# EAGLE design working (EAGLE 9.6.2)

## Sheet 1 of 2
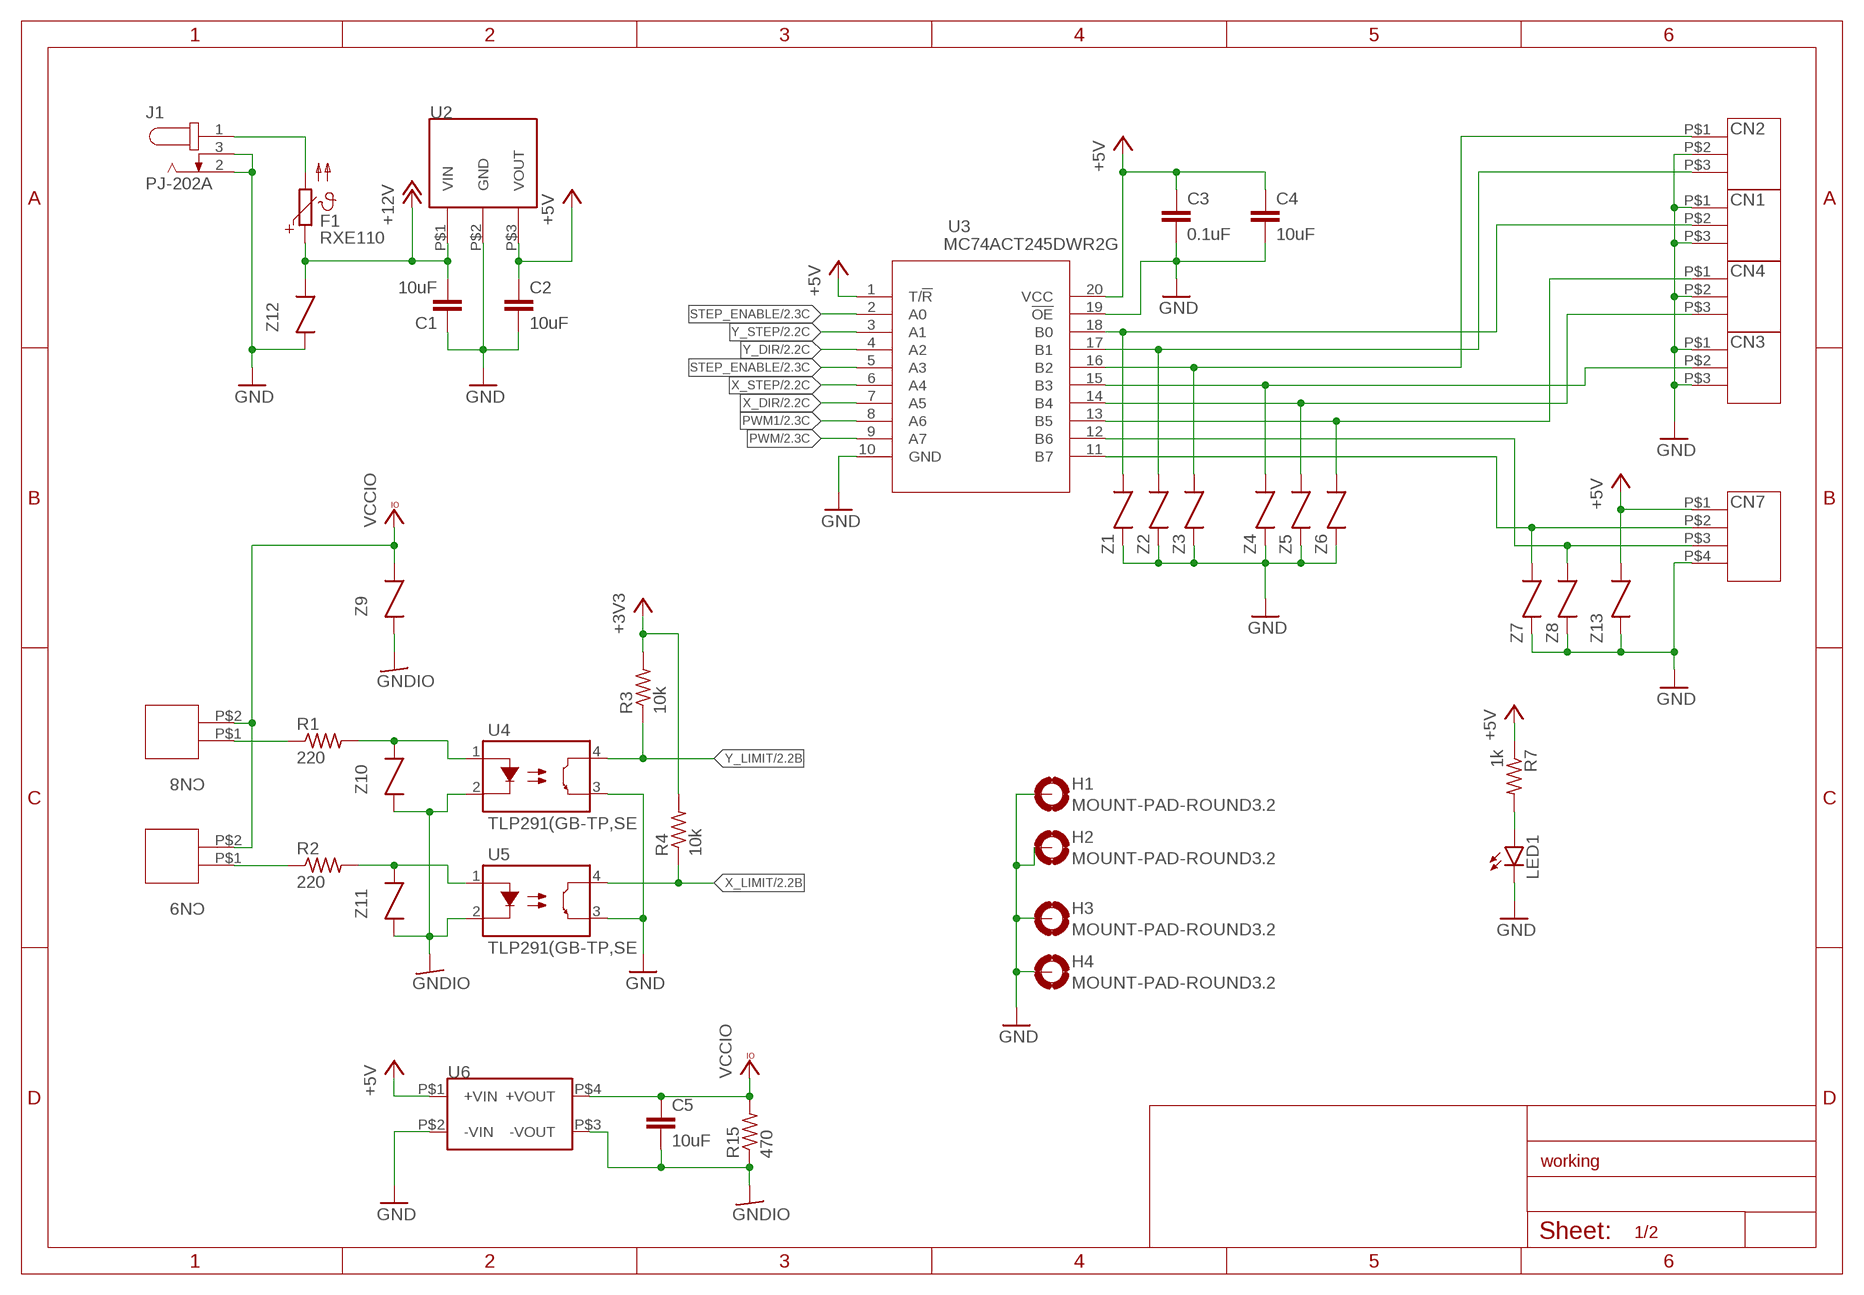
[diagram p0: schematic, sheet 1]

### Parts
C1  10uF  C-EUC0805  [C0805]
C2  10uF  C-EUC0805  [C0805]
C3  0.1uF  C-EUC0603  [C0603]
C4  10uF  C-EUC0805  [C0805]
C5  10uF  C-EUC0805  [C0805]
CN1  ETB43034G000Z  [ETB43034G000Z]
CN2  ETB43034G000Z  [ETB43034G000Z]
CN3  ETB43034G000Z  [ETB43034G000Z]
CN4  ETB43034G000Z  [ETB43034G000Z]
CN7  ETB43044G000Z  [ETB43044G000Z]
CN8  ETB43024G000Z  [ETB43024G000Z]
CN9  ETB43024G000Z  [ETB43024G000Z]
F1  RXE110  [RXE110]
H1  MOUNT-PAD-ROUND3.2  [3,2-PAD]
H2  MOUNT-PAD-ROUND3.2  [3,2-PAD]
H3  MOUNT-PAD-ROUND3.2  [3,2-PAD]
H4  MOUNT-PAD-ROUND3.2  [3,2-PAD]
J1  PJ-202A  [CUI_PJ-202A]
LED1  LED3MM  [LED3MM]
R1  220  R-US_R0603  [R0603]
R2  220  R-US_R0603  [R0603]
R3  10k  R-US_R0603  [R0603]
R4  10k  R-US_R0603  [R0603]
R7  1k  R-US_R0603  [R0603]
R15  470  R-US_R0603  [R0603]
U2  BP5293-50BP5293_SIDE  [BP5293_SIDE]
U3  MC74ACT245DWR2G  [SOIC-20WB_ONS]
U4  TLP291(GB-TP,SE  [SOIC127P700X220-4N]
U5  TLP291(GB-TP,SE  [SOIC127P700X220-4N]
U6  MAU102  [MAU100_SINGLE]
Z1  MLVC06V012C210  [0603]
Z2  MLVC06V012C210  [0603]
Z3  MLVC06V012C210  [0603]
Z4  MLVC06V012C210  [0603]
Z5  MLVC06V012C210  [0603]
Z6  MLVC06V012C210  [0603]
Z7  MLVC06V012C210  [0603]
Z8  MLVC06V012C210  [0603]
Z9  MLVC06V012C210  [0603]
Z10  MLVC06V012C210  [0603]
Z11  MLVC06V012C210  [0603]
Z12  MLVC06V026C120  [0603]
Z13  MLVC06V012C210  [0603]

### Nets
+3V3: R3.2 R4.2 ; also sheet 2
+5V: C2.2 C3.1 C4.2 CN7.P$1 R7.1 U2.P$3(VOUT) U3.1(T/!R) U3.20(VCC) U6.P$1(+VIN) Z13.1 ; also sheet 2
+12V: C1.2 F1.P$1 U2.P$1(VIN) Z12.1
GND: C1.1 C2.1 C3.2 C4.1 CN1.P$1 CN1.P$3 CN2.P$2 CN3.P$1 CN3.P$3 CN4.P$2 CN7.P$4 H1.B3,2(MOUNT) H2.B3,2(MOUNT) H3.B3,2(MOUNT) H4.B3,2(MOUNT) J1.2 J1.3 LED1.K(C) U2.P$2(GND) U3.10(GND) U3.19(!OE) U4.3(EMIT) U5.3(EMIT) U6.P$2(-VIN) Z1.2 Z2.2 Z3.2 Z4.2 Z5.2 Z6.2 Z7.2 Z8.2 Z12.2 Z13.2 ; also sheet 2
GNDIO: C5.1 R15.1 U4.2(C) U5.2(C) U6.P$3(-VOUT) Z9.2 Z10.2 Z11.2
LED1_PWM_5: CN7.P$3 U3.12(B6) Z8.1
LED_PWM_5: CN7.P$2 U3.11(B7) Z7.1
N$1: F1.P$2 J1.1
N$6: LED1.A R7.2
N$12: R1.2 U4.1(A) Z10.1
N$13: R2.2 U5.1(A) Z11.1
PWM: U3.9(A7) ; also sheet 2
PWM1: U3.8(A6) ; also sheet 2
STEP_EN_X_5: CN3.P$2 U3.15(B3) Z4.1
STEP_EN_Y_5: CN1.P$2 U3.18(B0) Z1.1
STEP_ENABLE: U3.2(A0) U3.5(A3) ; also sheet 2
VCCIO: C5.2 CN8.P$2 CN9.P$2 R15.2 U6.P$4(+VOUT) Z9.1
X_DIR: U3.7(A5) ; also sheet 2
X_DIR_5: CN4.P$1 U3.13(B5) Z6.1
X_LIMIT: R4.1 U5.4(COL) ; also sheet 2
X_LIMIT_IO: CN9.P$1 R2.1
X_STEP: U3.6(A4) ; also sheet 2
X_STEP_5: CN4.P$3 U3.14(B4) Z5.1
Y_DIR: U3.4(A2) ; also sheet 2
Y_DIR_5: CN2.P$1 U3.16(B2) Z3.1
Y_LIMIT: R3.1 U4.4(COL) ; also sheet 2
Y_LIMIT_IO: CN8.P$1 R1.1
Y_STEP: U3.3(A1) ; also sheet 2
Y_STEP_5: CN2.P$3 U3.17(B1) Z2.1

## Sheet 2 of 2
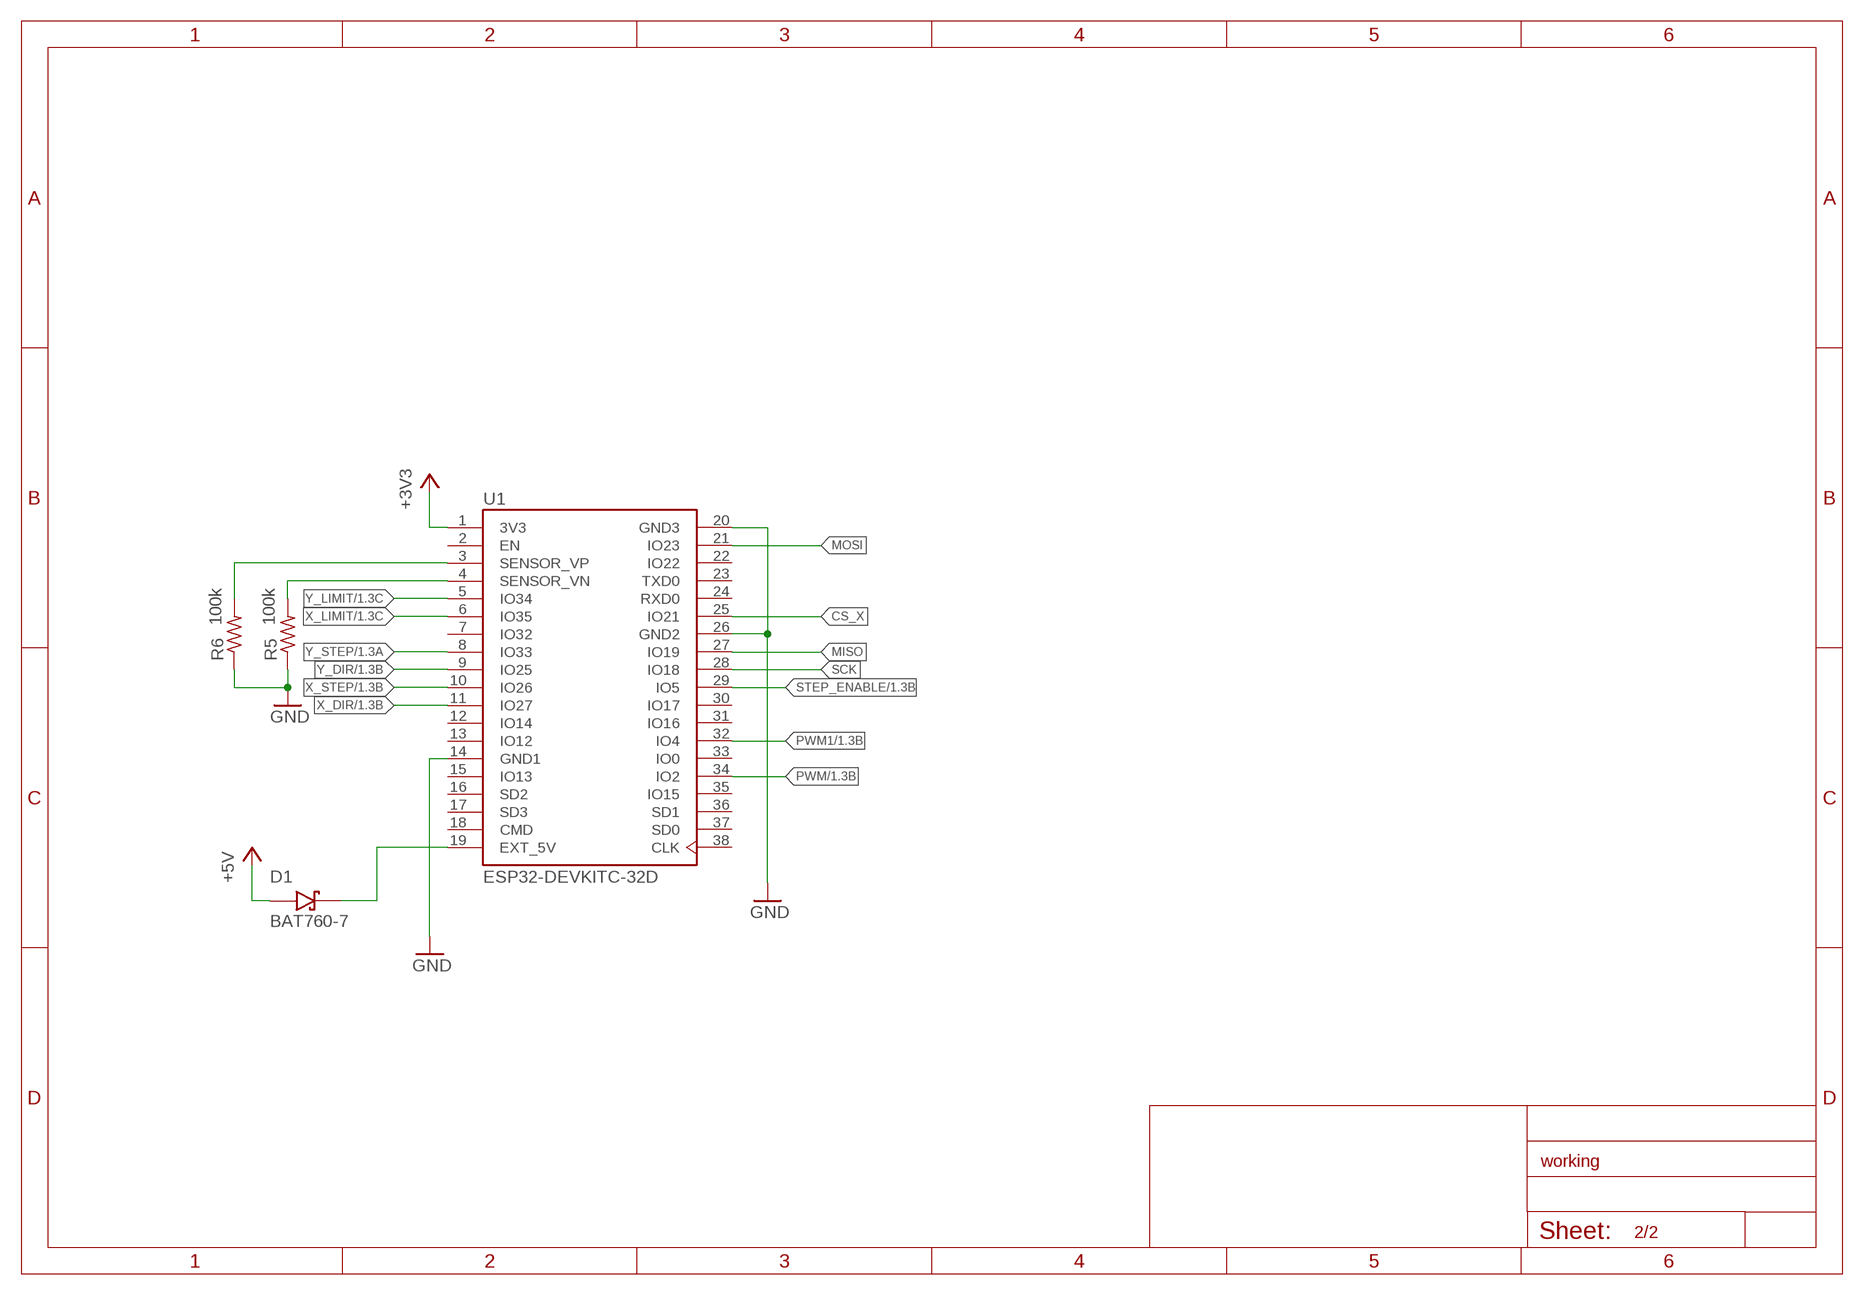
[diagram p1: schematic, sheet 2]

### Parts
D1  BAT760-7  [SOD2513X120N]
R5  100k  R-US_R0603  [R0603]
R6  100k  R-US_R0603  [R0603]
U1  ESP32-DEVKITC-32D  [MODULE_ESP32-DEVKITC-32D]

### Nets
+3V3: U1.1(3V3) ; also sheet 1
+5V: D1.A ; also sheet 1
CS_X: U1.25(IO21)
GND: R5.1 R6.1 U1.14(GND1) U1.20(GND3) U1.26(GND2) ; also sheet 1
MISO: U1.27(IO19)
MOSI: U1.21(IO23)
N$2: D1.C(K) U1.19(EXT_5V)
N$15: R6.2 U1.3(SENSOR_VP)
N$16: R5.2 U1.4(SENSOR_VN)
PWM: U1.34(IO2) ; also sheet 1
PWM1: U1.32(IO4) ; also sheet 1
SCK: U1.28(IO18)
STEP_ENABLE: U1.29(IO5) ; also sheet 1
X_DIR: U1.11(IO27) ; also sheet 1
X_LIMIT: U1.6(IO35) ; also sheet 1
X_STEP: U1.10(IO26) ; also sheet 1
Y_DIR: U1.9(IO25) ; also sheet 1
Y_LIMIT: U1.5(IO34) ; also sheet 1
Y_STEP: U1.8(IO33) ; also sheet 1
Unconnected: U1.2(EN) U1.7(IO32) U1.12(IO14) U1.13(IO12) U1.15(IO13) U1.16(SD2) U1.17(SD3) U1.18(CMD) U1.22(IO22) U1.23(TXD0) U1.24(RXD0) U1.30(IO17) U1.31(IO16) U1.33(IO0) U1.35(IO15) U1.36(SD1) U1.37(SD0) U1.38(CLK)

## Library data of the parts
C1-C5 = 2_Axis_External_Driver:C-EU: CAPACITOR, European symbol; SPICEPREFIX: C
CN1-CN4 = 2_Axis_External_Driver:ETB43034G000Z: ETB43034G000Z https://akizukidenshi.com/download/ds/alphaplus/etb43.pdf
CN7 = 2_Axis_External_Driver:ETB43044G000Z: ETB43044G000Z https://akizukidenshi.com/catalog/g/gP-11601/
CN8 CN9 = 2_Axis_External_Driver:ETB43024G000Z: ETB43024G000Z https://akizukidenshi.com/catalog/g/gP-11599/
D1 = 2_Axis_External_Driver:BAT760-7: Diode Schottky 30V 1A Surface Mount SOD-323 Check availability <https://pricing.snapeda.com/parts/BAT760-7/Diodes%20Inc./view-part?ref=eda>; AVAILABILITY: In Stock; DESCRIPTION: Diode Schottky 30 V 1A Surface Mount SOD-323; MF: Diodes Inc.; MP: BAT760-7; PACKAGE: SOD-323 Diodes Inc.; PRICE: None; PURCHASE-URL: https://pricing.snapeda.com/search/part/BAT760-7/?ref=eda
F1 = 2_Axis_External_Driver:RXE110: https://akizukidenshi.com/catalog/g/gP-00273/
H1-H4 = 2_Axis_External_Driver:MOUNT-PAD-ROUND: MOUNTING PAD, round
J1 = 2_Axis_External_Driver:PJ-202A: 2.0 mm Center Pin, 2.5 A, Right Angle, Through Hole, Kinked Pins, Dc Power Jack Connector Check prices <https://pricing.snapeda.com/parts/PJ-202A/CUI%20Devices/view-part?ref=eda>; AVAILABILITY: In Stock; CUI_PURCHASE_URL: https://www.cuidevices.com/product/interconnect/connectors/dc-power-connectors/jacks/pj-202a?utm_source=snapeda.com&utm_medium=referral&utm_campaign=snapedaBOM; DESCRIPTION: 2.0 x 6.5 mm, 2.5 A, Horizontal, Through Hole, Kinked Pins, Dc Power Jack Connector; MF: CUI Devices; MP: PJ-202A; PACKAGE: None; PRICE: None; PURCHASE-URL: https://pricing.snapeda.com/search/part/PJ-202A/?ref=eda
LED1 = 2_Axis_External_Driver:LED: LED OSRAM: - CHIPLED LG R971, LG N971, LY N971, LG Q971, LY Q971, LO R971, LY R971 LH N974, LH R974 LS Q976, LO Q976, LY Q976 LO Q996 - Hyper CHIPLED LW Q18S LB Q993, LB Q99A, LB R99A - SideLED LS A670, LO A670, LY A670, LG A670, LP A670 LB A673, LV A673, LT A673, LW A673 LH A674 LY A675 LS A676, LA A676, LO A676, LY A676, LW A676 LS A679, LY A679, LG A679 - Hyper Micro SIDELED® LS Y876, LA Y876, LO Y876, LY Y876 LT Y87S - SmartLED LW L88C, LW L88S LB L89C, LB L89S, LG L890 LS L89K, LO L89K, LY L89K LS L896, LA L896, LO L896, LY L896 - TOPLED LS T670, LO T670, LY T670, LG T670, LP T670 LSG T670, LSP T670, LSY T670, LOP T670, LYG T670 LG T671, LOG T671, LSG T671 LB T673, LV T673, LT T673, LW T673 LH T674 LS T676, LA T676, LO T676, LY T676, LB T676, LH T676, LSB T676, LW T676 LB T67C, LV T67C, LT T67C, LS T67K, LO T67K, LY T67K, LW E67C LS E67B, LA E67B, LO E67B, LY E67B, LB E67C, LV E67C, LT E67C LW T67C LS T679, LY T679, LG T679 LS T770, LO T770, LY T770, LG T770, LP T770 LB T773, LV T773, LT T773, LW T773 LH T774 LS E675, LA E675, LY E675, LS T675 LS T776, LA T776, LO T776, LY T776, LB T776 LHGB T686 LT T68C, LB T68C - Hyper Mini TOPLED® LB M676 - Mini TOPLED Santana® LG M470 LS M47K, LO M47K, LY M47K Source: http://www.osram.convergy.de LUXEON: - LUMILED® LXK2-PW12-R00, LXK2-PW12-S00, LXK2-PW14-U00, LXK2-PW14-V00 LXK2-PM12-R00, LXK2-PM12-S00, LXK2-PM14-U00 LXK2-PE12-Q00, LXK2-PE12-R00, LXK2-PE12-S00, LXK2-PE14-T00, LXK2-PE14-U00 LXK2-PB12-K00, LXK2-PB12-L00, LXK2-PB12-M00, LXK2-PB14-N00, LXK2-PB14-P00, LXK2-PB14-Q00 LXK2-PR12-L00, LXK2-PR12-M00, LXK2-PR14-Q00, LXK2-PR14-R00 LXK2-PD12-Q00, LXK2-PD12-R00, LXK2-PD12-S00 LXK2-PH12-R00, LXK2-PH12-S00 LXK2-PL12-P00, LXK2-PL12-Q00, LXK2-PL12-R00 Source: www.luxeon.com KINGBRIGHT: KA-3528ASYC Source: www.kingbright.com
R1-R7 R15 = 2_Axis_External_Driver:R-US_: RESISTOR, American symbol; SPICEPREFIX: R
U1 = 2_Axis_External_Driver:ESP32-DEVKITC-32D: Eval Board For Esp-Wroom-32 Check prices <https://pricing.snapeda.com/parts/ESP32-DEVKITC-32D/Espressif%20Systems/view-part?ref=eda>; AVAILABILITY: In Stock; DESCRIPTION: WiFi Development Tools (802.11) ESP32 General Development Kit, ESP32-WROOM-32D on the board; MF: Espressif Systems; MP: ESP32-DEVKITC-32D; PACKAGE: None; PRICE: None
U2 = 2_Axis_External_Driver:BP5293-50: BP5293 https://akizukidenshi.com/catalog/g/gM-11188/
U3 = 2_Axis_External_Driver:MC74ACT245DWR2G; COPYRIGHT: Copyright (C) 2022 Ultra Librarian. All rights reserved.; MANUFACTURER_PART_NUMBER: MC74ACT245DWR2G; MFR_NAME: onsemi
U4 U5 = 2_Axis_External_Driver:TLP291(GB-TP,SE: Optoisolator Transistor Output 3750Vrms 1 Channel 4-SO Check availability <https://pricing.snapeda.com/parts/TLP291%28GB-TP%2CSE/Toshiba%20Semiconductor/view-part?ref=eda>; AVAILABILITY: In Stock; DESCRIPTION: Optoisolator Transistor Output 3750Vrms 1 Channel 4-SO; MF: Toshiba Semiconductor; MP: TLP291(GB-TP,SE; PACKAGE: SO-4 Toshiba Semiconductor; PRICE: None; PURCHASE-URL: https://pricing.snapeda.com/search/part/TLP291(GB-TP,SE/?ref=eda
U6 = 2_Axis_External_Driver:MAU102: https://akizukidenshi.com/catalog/g/gM-04131/
Z1-Z11 Z13 = 2_Axis_External_Driver:MLVC06V012C210: https://www.mouser.jp/ProductDetail/Bussmann-Eaton/MLVC06V012C210?qs=pUKx8fyJudBlDBwUQ7TVbQ%3D%3D バリスタ 12VDC 210PF
Z12 = 2_Axis_External_Driver:MLVC06V026C120: https://www.mouser.jp/ProductDetail/Bussmann-Eaton/MLVC06V026C120?qs=pUKx8fyJudD3x2tRqD2agg%3D%3D バリスタ 26VDC 120PF

## Board
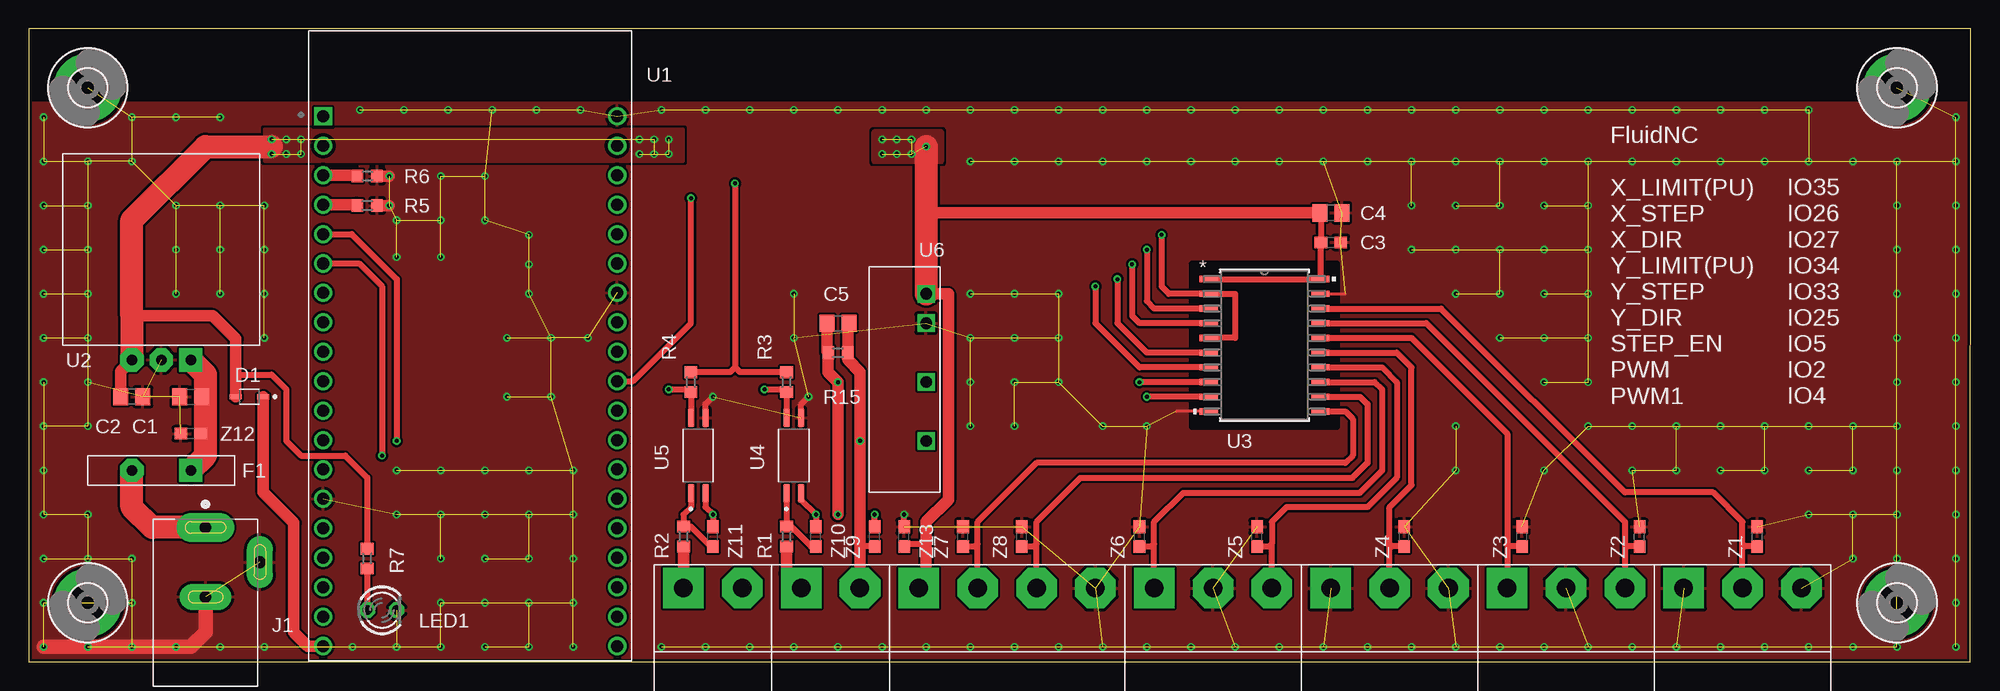
[diagram p2: board, top side]
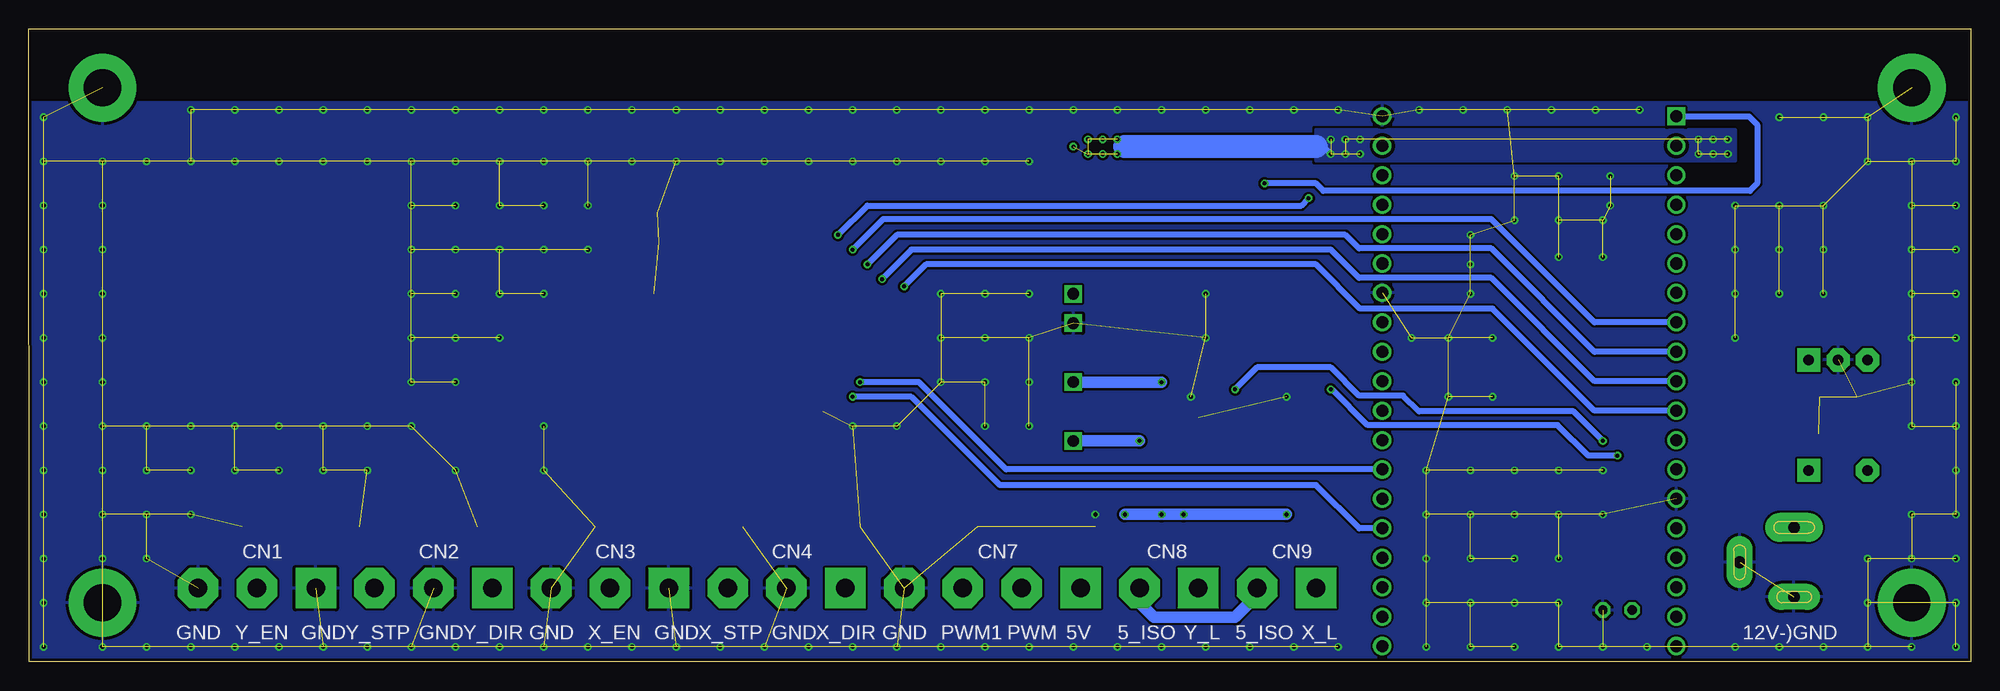
[diagram p3: board, bottom side, seen from below]

Size 167.64 x 54.61 mm. Coordinates in mm from the lower left corner, seen from the top.
Outline: 0,0 167.62,0 167.64,54.61 0,54.61 0,0
Copper layers (1*16): Top 0.035mm / dielectric 1.5mm / Bottom 0.035mm
Design rules "SeeedStudio_2layer_DRU_no_angle_20140221": minimum track width 6mil, minimum drill 12mil, track to track 6mil, track to pad 6mil, pad to pad 6mil, via to via 6mil, smd to smd 0mil, copper to edge 10mil, drill to drill 10mil, minimum pad ring 10mil, minimum via ring 6mil, stop-mask expansion 2mil, vias tented up to drill 100mil, thermal gap 10mil

### Footprints (pad centres in the part's own frame; a part is rotated, then mirrored left to right if it is on the bottom)
C0805 = smd 1.3 x 1.5: 1 -0.95,0; 2 0.95,0
C0603 = smd 1.1 x 1: 1 -0.85,0; 2 0.85,0
ETB43034G000Z = drill 1.6 pad 3.5 square: P$1 -5.08,0 | drill 1.6 pad 3.5 octagon: P$2 0,0; P$3 5.08,0
ETB43044G000Z = drill 1.6 pad 3.5 square: P$1 -7.62,0 | drill 1.6 pad 3.5 octagon: P$2 -2.54,0; P$3 2.54,0; P$4 7.62,0
ETB43024G000Z = drill 1.6 pad 3.5 square: P$1 -2.54,0 | drill 1.6 pad 3.5 octagon: P$2 2.54,0
SOD2513X120N = smd 1.04 x 0.46: A 1.19,0; C -1.19,0
RXE110 = drill 0.9 pad 2 square: P$1 0,0 | drill 0.9 pad 2 octagon: P$2 5.08,0
3,2-PAD = drill 3.2 pad 5.842: B3,2 0,0
CUI_PJ-202A = drill 1 pad 2.5 long: 1 -6.5,0 | drill 1 pad 2.25 long: 2 -0.5,0; 3 -3.5,4.7
LED3MM = drill 0.813 octagon: A -1.27,0; K 1.27,0
R0603 = smd 1 x 1.1: 1 -0.85,0; 2 0.85,0
MODULE_ESP32-DEVKITC-32D = drill 1.04 square: 1 -12.7,19.76 | drill 1.04: 2 -12.7,17.22; 3 -12.7,14.68; 4 -12.7,12.14; 5 -12.7,9.6; 6 -12.7,7.06; 7 -12.7,4.52; 8 -12.7,1.98; 9 -12.7,-0.56; 10 -12.7,-3.1; 11 -12.7,-5.64; 12 -12.7,-8.18; 13 -12.7,-10.72; 14 -12.7,-13.26; 15 -12.7,-15.8; 16 -12.7,-18.34; 17 -12.7,-20.88; 18 -12.7,-23.42; 19 -12.7,-25.96; 20 12.7,19.76; 21 12.7,17.22; 22 12.7,14.68; 23 12.7,12.14; 24 12.7,9.6; 25 12.7,7.06; 26 12.7,4.52; 27 12.7,1.98; 28 12.7,-0.56; 29 12.7,-3.1; 30 12.7,-5.64; 31 12.7,-8.18; 32 12.7,-10.72; 33 12.7,-13.26; 34 12.7,-15.8; 35 12.7,-18.34; 36 12.7,-20.88; 37 12.7,-23.42; 38 12.7,-25.96
BP5293_SIDE = drill 0.9 pad 2 square: P$1 -2.54,0 | drill 0.9 pad 2 octagon: P$2 0,0; P$3 2.54,0
SOIC-20WB_ONS = smd 1.589 x 0.533: 1 -4.826,5.715; 2 -4.826,4.445; 3 -4.826,3.175; 4 -4.826,1.905; 5 -4.826,0.635; 6 -4.826,-0.635; 7 -4.826,-1.905; 8 -4.826,-3.175; 9 -4.826,-4.445; 10 -4.826,-5.715; 11 4.826,-5.715; 12 4.826,-4.445; 13 4.826,-3.175; 14 4.826,-1.905; 15 4.826,-0.635; 16 4.826,0.635; 17 4.826,1.905; 18 4.826,3.175; 19 4.826,4.445; 20 4.826,5.715
SOIC127P700X220-4N = smd 1.61 x 0.57: 1 -3.25,0.635; 2 -3.25,-0.635; 3 3.25,-0.635; 4 3.25,0.635
MAU100_SINGLE = drill 1 square: P$1 0,0; P$2 2.54,0; P$3 7.62,0; P$4 12.7,0
0603 = smd 1.1 x 1: 1 -0.85,0; 2 0.85,0

### Placement (x,y rotation side)
C1  13.97,22.86 0 top
C2  8.89,22.86 180 top
C3  112.39,36.2 0 top
C4  112.39,38.73 180 top
C5  69.85,29.21 0 top
CN1  147.96,6.35 0 top
CN2  132.72,6.35 0 top
CN3  117.47,6.35 0 top
CN4  102.23,6.35 0 top
CN7  84.45,6.35 0 top
CN8  69.22,6.35 0 top
CN9  59.05,6.35 0 top
D1  19.05,22.86 180 top
F1  13.97,16.51 180 top
H1  5.08,49.53 0 top
H2  5.08,5.08 0 top
H3  161.29,5.08 0 top
H4  161.29,49.53 0 top
J1  15.24,5.08 270 top
LED1  30.48,4.45 0 top
R1  65.41,10.79 90 top
R2  56.52,10.79 90 top
R3  65.41,24.13 90 top
R4  57.15,24.13 90 top
R5  29.21,39.37 180 top
R6  29.21,41.91 180 top
R7  29.21,8.89 270 top
R15  69.85,26.67 0 top
U1  38.1,27.3 0 top
U2  11.43,26.04 180 top
U3  106.68,27.3 0 top
U4  66.04,17.78 90 top
U5  57.78,17.78 90 top
U6  77.47,31.75 270 top
Z1  149.22,10.79 90 top
Z2  139.06,10.79 90 top
Z3  128.91,10.79 90 top
Z4  118.75,10.79 90 top
Z5  106.05,10.79 90 top
Z6  95.89,10.79 90 top
Z7  80.64,10.79 90 top
Z8  85.72,10.79 90 top
Z9  73.03,10.79 90 top
Z10  67.94,10.79 90 top
Z11  59.05,10.79 90 top
Z12  13.97,19.68 180 top
Z13  75.56,10.79 90 top

### Tracks (layer width: path | path; a pad name or v marks a point on that pad's centre or on a via)
+3V3  (via drill 0.35)
  Top 0.5: v60.96,41.27 60.96,25.4 | 60.96,25.4 60.54,24.98 R4.2 | R3.2 61.38,24.98 60.96,25.4
  Bottom 0.5: U1.1 19.12,47.06 18.41,46.35 18.41,41.27 19.05,40.64 55.88,40.64 56.52,41.27 v60.96,41.27
+5V  (via drill 0.35)  (17 unrouted)
  Top 0.5: U3.1 U3.20 111.51,36.16 C3.1 111.55,38.63 C4.2 | Z13.1 75.78,10.16 77.47,10.16 | 17.86,24.77 20.95,24.77 22.23,23.5 22.23,19.05 23.5,17.78 27.3,17.78 29.21,15.88 R7.1 | 20.95,44.45 v20.95,45.09
  Top 1: C2.2 7.94,25.09 U2.P$3 | D1.A 17.86,24.77 17.86,27.86 15.88,29.84 8.89,29.84 | CN7.P$1 77.47,6.99 77.47,10.16 77.47,12.06 79.38,13.97 79.38,31.75 U6.P$1 | C4.2 77.47,38.73
  Top 2: U2.P$3 8.89,29.84 8.89,38.1 15.24,44.45 20.95,44.45 | v77.47,44.45 77.47,38.73 U6.P$1
  Bottom 0.5: v55.24,43.81 55.88,44.45 56.52,44.45 | 73.03,44.45 v73.66,45.09
  Bottom 2: 56.52,44.45 73.03,44.45
  other vias: 22.23,45.09 22.23,43.81 20.95,43.81 23.5,45.09 23.5,43.81 52.7,45.09 52.7,43.81 53.98,45.09 53.98,43.81 55.24,45.09 74.93,45.09 74.93,43.81 76.2,43.81 76.2,45.09 73.66,43.81
  pour Top (isolate 0.3): 20.32,45.97 20.32,43.18 56.52,43.18 56.52,45.97
  pour Bottom (isolate 0.3): 20.32,45.97 20.32,43.18 56.52,43.18 56.52,45.97
  pour Top: 73.03,45.72 78.74,45.72 78.74,43.18 73.03,43.18
+12V
  Top 0.5: C1.2 15.24,22.86 | Z12.1 15.24,19.68
  Top 2: F1.P$1 15.24,17.78 15.24,19.68 15.24,22.86 15.24,24.77 U2.P$1
GND  (via drill 0.35)  (278 unrouted)
  Top 0.25: U3.10 99.06,21.59 | U3.19 113.67,31.75
  Top 0.5: U4.3 66.67,22.23 v67.31,22.86 | U5.3 58.42,22.23 v59.05,22.86 | Z13.2 v75.56,12.7
  Top 1: R6.1 v31.11,41.91 | R5.1 v31.11,39.37
  Top 1.27: J1.2 15.24,2.54 13.97,1.27 v1.27,1.27
  other vias: 45.09,27.94 45.09,22.86 48.26,27.94 43.18,34.29 43.18,36.83 43.18,31.75 41.27,27.94 41.27,22.86 1.27,5.08 1.27,8.89 1.27,12.7 1.27,16.51 1.27,20.32 1.27,24.13 1.27,27.94 1.27,31.75 1.27,35.56 1.27,39.37 1.27,43.18 1.27,46.99 28.57,47.62 32.38,47.62 36.2,47.62 40.01,47.62 43.81,47.62 47.62,47.62 54.61,47.62 58.42,47.62 62.23,47.62 66.04,47.62 69.85,47.62 73.66,47.62 77.47,47.62 81.28,47.62 85.09,47.62 88.9,47.62 92.71,47.62 96.52,47.62 100.33,47.62 104.14,47.62 107.95,47.62 111.76,47.62 115.57,47.62 119.38,47.62 123.19,47.62 166.37,46.99 166.37,39.37 166.37,43.18 166.37,31.75 166.37,35.56 166.37,24.13 166.37,27.94 166.37,16.51 166.37,20.32 166.37,8.89 166.37,12.7 166.37,1.27 166.37,5.08 157.48,1.27 161.29,1.27 115.57,1.27 119.38,1.27 123.19,1.27 104.14,1.27 107.95,1.27 111.76,1.27 92.71,1.27 96.52,1.27 100.33,1.27 81.28,1.27 85.09,1.27 88.9,1.27 69.85,1.27 73.66,1.27 77.47,1.27 58.42,1.27 62.23,1.27 66.04,1.27 46.99,1.27 54.61,1.27 35.56,1.27 39.37,1.27 43.18,1.27 27.94,1.27 31.75,1.27 12.7,1.27 16.51,1.27 20.32,1.27 5.08,1.27 8.89,1.27 12.7,46.99 8.89,46.99 8.89,43.18 5.08,43.18 5.08,39.37 5.08,35.56 5.08,31.75 5.08,27.94 5.08,24.13 5.08,20.32 5.08,12.7 5.08,8.89 8.89,8.89 8.89,5.08 35.56,5.08 39.37,5.08 43.18,5.08 46.99,5.08 35.56,8.89 39.37,8.89 43.18,8.89 46.99,8.89 46.99,12.7 43.18,12.7 39.37,12.7 35.56,12.7 31.75,12.7 31.75,16.51 35.56,16.51 39.37,16.51 43.18,16.51 46.99,16.51 39.37,41.91 35.56,41.91 39.37,38.1 35.56,38.1 35.56,34.92 31.75,34.92 31.75,38.1 16.51,39.37 20.32,39.37 12.7,39.37 20.32,35.56 16.51,35.56 12.7,35.56 12.7,31.75 16.51,31.75 20.32,31.75 20.32,27.94 161.29,43.18 161.29,39.37 161.29,35.56 161.29,31.75 161.29,27.94 161.29,24.13 161.29,20.32 161.29,16.51 161.29,12.7 161.29,8.89 157.48,43.18 157.48,20.32 157.48,16.51 157.48,12.7 157.48,8.89 153.67,12.7 153.67,16.51 153.67,20.32 88.9,31.75 88.9,27.94 85.09,31.75 85.09,27.94 81.28,31.75 81.28,27.94 88.9,24.13 85.09,24.13 81.28,24.13 81.28,20.32 85.09,20.32 92.71,20.32 96.52,20.32 16.51,46.99 153.67,43.18 127,47.62 130.81,47.62 134.62,47.62 138.43,47.62 142.24,47.62 146.05,47.62 149.86,47.62 153.67,47.62 149.86,43.18 149.86,20.32 149.86,16.51 146.05,43.18 146.05,20.32 146.05,16.51 142.24,16.51 142.24,20.32 142.24,43.18 146.05,1.27 149.86,1.27 153.67,1.27 134.62,1.27 138.43,1.27 142.24,1.27 127,1.27 130.81,1.27 138.43,43.18 138.43,20.32 134.62,20.32 134.62,24.13 134.62,27.94 134.62,31.75 134.62,35.56 134.62,39.37 134.62,43.18 138.43,16.51 130.81,24.13 130.81,27.94 130.81,31.75 130.81,35.56 130.81,39.37 130.81,43.18 127,27.94 127,31.75 127,35.56 127,39.37 127,43.18 123.19,31.75 123.19,35.56 123.19,39.37 123.19,43.18 81.28,43.18 85.09,43.18 88.9,43.18 92.71,43.18 96.52,43.18 100.33,43.18 104.14,43.18 107.95,43.18 111.76,43.18 115.57,43.18 119.38,35.56 119.38,39.37 119.38,43.18 130.81,16.51 123.19,16.51 123.19,20.32 66.04,31.75 66.04,27.94
  pour Top (isolate 0.2, rank 2): 0,0 0,48.26 167.64,48.26 167.64,0
  pour Bottom (isolate 0.2, rank 2): 0,0 0,48.26 167.64,48.26 167.64,0
GNDIO  (via drill 0.35)
  Top 0.5: U5.2 58.42,13.34 v59.05,12.7 Z11.2 | U4.2 66.67,13.97 v67.94,12.7 Z10.2 | Z9.2 v73.03,12.7
  Top 1: v69.85,12.7 v69.85,24.13 69,24.98 R15.1 68.9,26.77 C5.1
  Bottom 1: v59.05,12.7 v67.94,12.7 v69.85,12.7 v73.03,12.7 | U6.P$3 v69.85,24.13
LED1_PWM_5
  Top 0.5: CN7.P$3 87,10.16 | Z8.1 86.78,9.95 87,10.16 | 87,10.16 87,12.06 90.79,15.86 114.28,15.86 115.57,17.14 115.57,22.23 114.94,22.86 U3.12
LED_PWM_5
  Top 0.5: CN7.P$2 81.92,10.16 | Z7.1 81.7,9.95 81.92,10.16 | 81.92,10.16 81.92,12.06 87,17.14 113.67,17.14 114.3,17.78 114.3,20.95 113.67,21.59 U3.11
N$1
  Top 2: J1.1 10.64,11.58 8.89,13.34 F1.P$2
N$2
  Top 1: U1.19 24.05,1.34 22.86,2.54 22.86,11.98 20.24,14.61 D1.C
N$6
  Top 0.5: R7.2 LED1.A
N$12
  Top 0.5: U4.1 R1.2 65.83,11.64 67.53,9.95 Z10.1
N$13
  Top 0.5: Z11.1 58.85,9.95 57.15,11.64 R2.2 56.52,12.7 57.15,13.34 U5.1
N$15
  Top 1: U1.3 28.29,41.98 R6.2
N$16
  Top 1: U1.4 28.29,39.45 R5.2
PWM  (via drill 0.35)
  Top 0.5: U3.9 v96.52,22.86
  Bottom 0.5: U1.34 52.78,11.51 56.52,15.24 83.82,15.24 91.44,22.86 v96.52,22.86
PWM1  (via drill 0.35)
  Top 0.5: U3.8 v95.89,24.13
  Bottom 0.5: U1.32 83.26,16.59 90.81,24.13 v95.89,24.13
STEP_EN_X_5
  Top 0.5: CN3.P$2 117.47,10.16 | Z4.1 117.69,9.95 117.47,10.16 | 117.47,10.16 117.47,13.34 119.38,15.24 119.38,25.4 118.11,26.67 U3.15
STEP_EN_Y_5
  Top 0.5: U3.18 121.92,30.48 137.79,14.61 145.41,14.61 147.96,12.06 147.96,10.16 | CN1.P$2 147.96,10.16 | Z1.1 148.17,9.95 147.96,10.16
STEP_ENABLE  (via drill 0.35)
  Top 0.5: U3.5 104.14,27.94 104.14,31.75 U3.2 98.42,31.75 97.79,32.38 v97.79,36.83 | U1.29 52.15,24.2 57.15,29.21 v57.15,40.01
  Bottom 0.5: v57.15,40.01 57.78,39.37 95.25,39.37 v97.79,36.83
VCCIO  (via drill 0.35)
  Top 0.5: Z9.1 71.97,9.95 71.75,10.16
  Top 1: CN8.P$2 71.75,10.16 v71.75,19.05 71.75,24.98 70.7,26.04 R15.2 70.7,29.11 C5.2
  Bottom 1: CN9.P$2 61.59,5.71 63.5,3.81 70.48,3.81 71.75,5.08 CN8.P$2 | v71.75,19.05 U6.P$4
X_DIR  (via drill 0.35)
  Top 0.5: v92.08,32.38 92.08,29.21 95.89,25.4 U3.7
  Bottom 0.5: U1.11 32.46,21.66 41.27,30.48 52.7,30.48 56.52,34.29 90.17,34.29 v92.08,32.38
X_DIR_5
  Top 0.5: CN4.P$1 97.16,10.16 | Z6.1 96.94,9.95 97.16,10.16 | 97.16,10.16 97.16,12.06 99.66,14.57 114.9,14.57 116.84,16.51 116.84,23.5 116.2,24.13 U3.13
X_LIMIT  (via drill 0.35)
  Top 0.5: U5.4 R4.1 57.15,23.5 v55.24,23.5 | U1.6 28.5,34.37 30.48,32.38 v30.48,17.78
  Bottom 0.5: v30.48,17.78 33.02,17.78 35.66,20.42 52.07,20.42 55.15,23.5 v55.24,23.5
X_LIMIT_IO
  Top 1: CN9.P$1 R2.1
X_STEP  (via drill 0.35)
  Top 0.5: v93.98,33.02 93.98,29.21 96.52,26.67 U3.6
  Bottom 0.5: U1.10 32.46,24.2 41.38,33.12 52.8,33.12 55.24,35.56 91.44,35.56 v93.98,33.02
X_STEP_5
  Top 0.5: CN4.P$3 107.31,10.16 | Z5.1 107.1,9.95 107.31,10.16 | U3.14 116.84,25.4 118.11,24.13 118.11,15.88 115.57,13.34 108.58,13.34 107.31,12.06 107.31,10.16
Y_DIR  (via drill 0.35)
  Top 0.5: v95.25,34.29 95.25,29.84 95.89,29.21 U3.4
  Bottom 0.5: U1.9 32.46,26.75 41.38,35.66 52.8,35.66 53.98,36.83 92.71,36.83 v95.25,34.29
Y_DIR_5
  Top 0.5: U3.16 119.38,27.94 127.64,19.68 127.64,10.16 | 127.64,10.16 CN2.P$1 | Z3.1 127.85,9.95 127.64,10.16
Y_LIMIT  (via drill 0.35)
  Top 0.5: U4.4 R3.1 65.19,23.5 v63.5,23.5 | U1.5 27.86,36.91 31.75,33.02 v31.75,19.05
  Bottom 0.5: v31.75,19.05 34.29,21.59 47.62,21.59 48.99,22.96 52.8,22.96 55.24,25.4 61.59,25.4 v63.5,23.5
Y_LIMIT_IO
  Top 1: R1.1 65.41,7.62 CN8.P$1
Y_STEP  (via drill 0.35)
  Top 0.5: v96.52,35.56 96.52,31.11 97.16,30.48 U3.3
  Bottom 0.5: U1.8 32.46,29.29 41.38,38.2 93.88,38.2 v96.52,35.56
Y_STEP_5
  Top 0.5: U3.17 120.65,29.21 137.79,12.06 137.79,10.16 | 137.79,10.16 CN2.P$3 | Z2.1 138.01,9.95 137.79,10.16

### Text on the board
tPlace: FluidNC / / X_LIMIT(PU) / X_STEP / X_DIR / Y_LIMIT(PU) / Y_STEP / Y_DIR / STEP_EN / PWM / PWM1 | IO35 / IO26 / IO27 / IO34 / IO33 / IO25 / IO5 / IO2 / IO4
bPlace: 12V-)GND | X_L | 5_ISO | Y_L | 5_ISO | 5V | PWM | PWM1 | GND | X_DIR | GND | X_STP | GND | X_EN | GND | Y_DIR | GND | Y_STP | GND | Y_EN | GND